# Altium schematic sheet MAIN_BOARD.SchDoc
size D; SheetNumber: 1; SheetTotal: 11
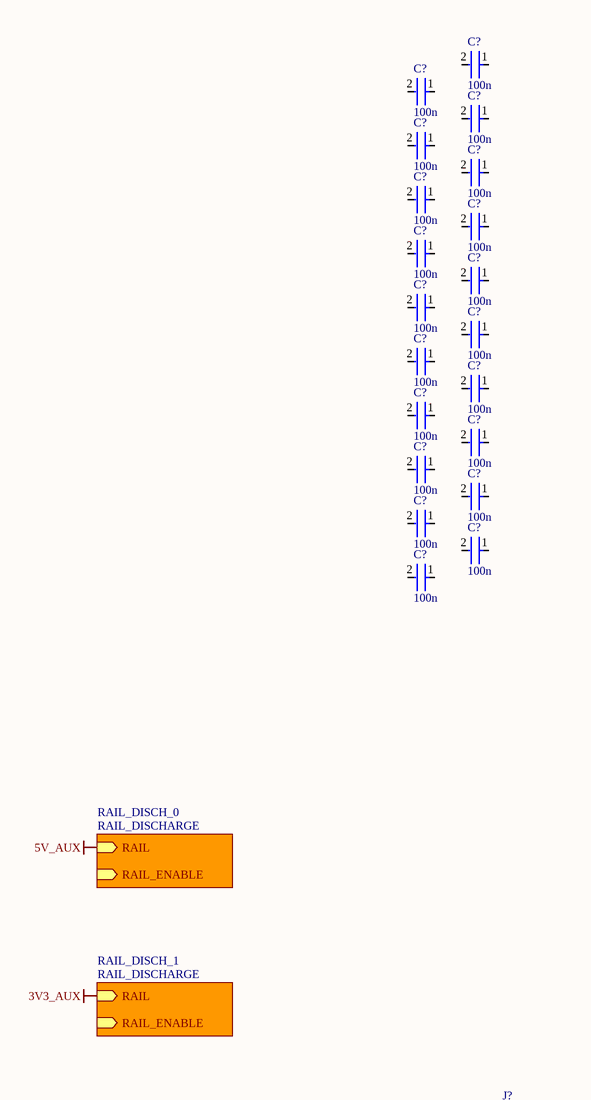
[diagram p0: MAIN_BOARD.SchDoc, top left]
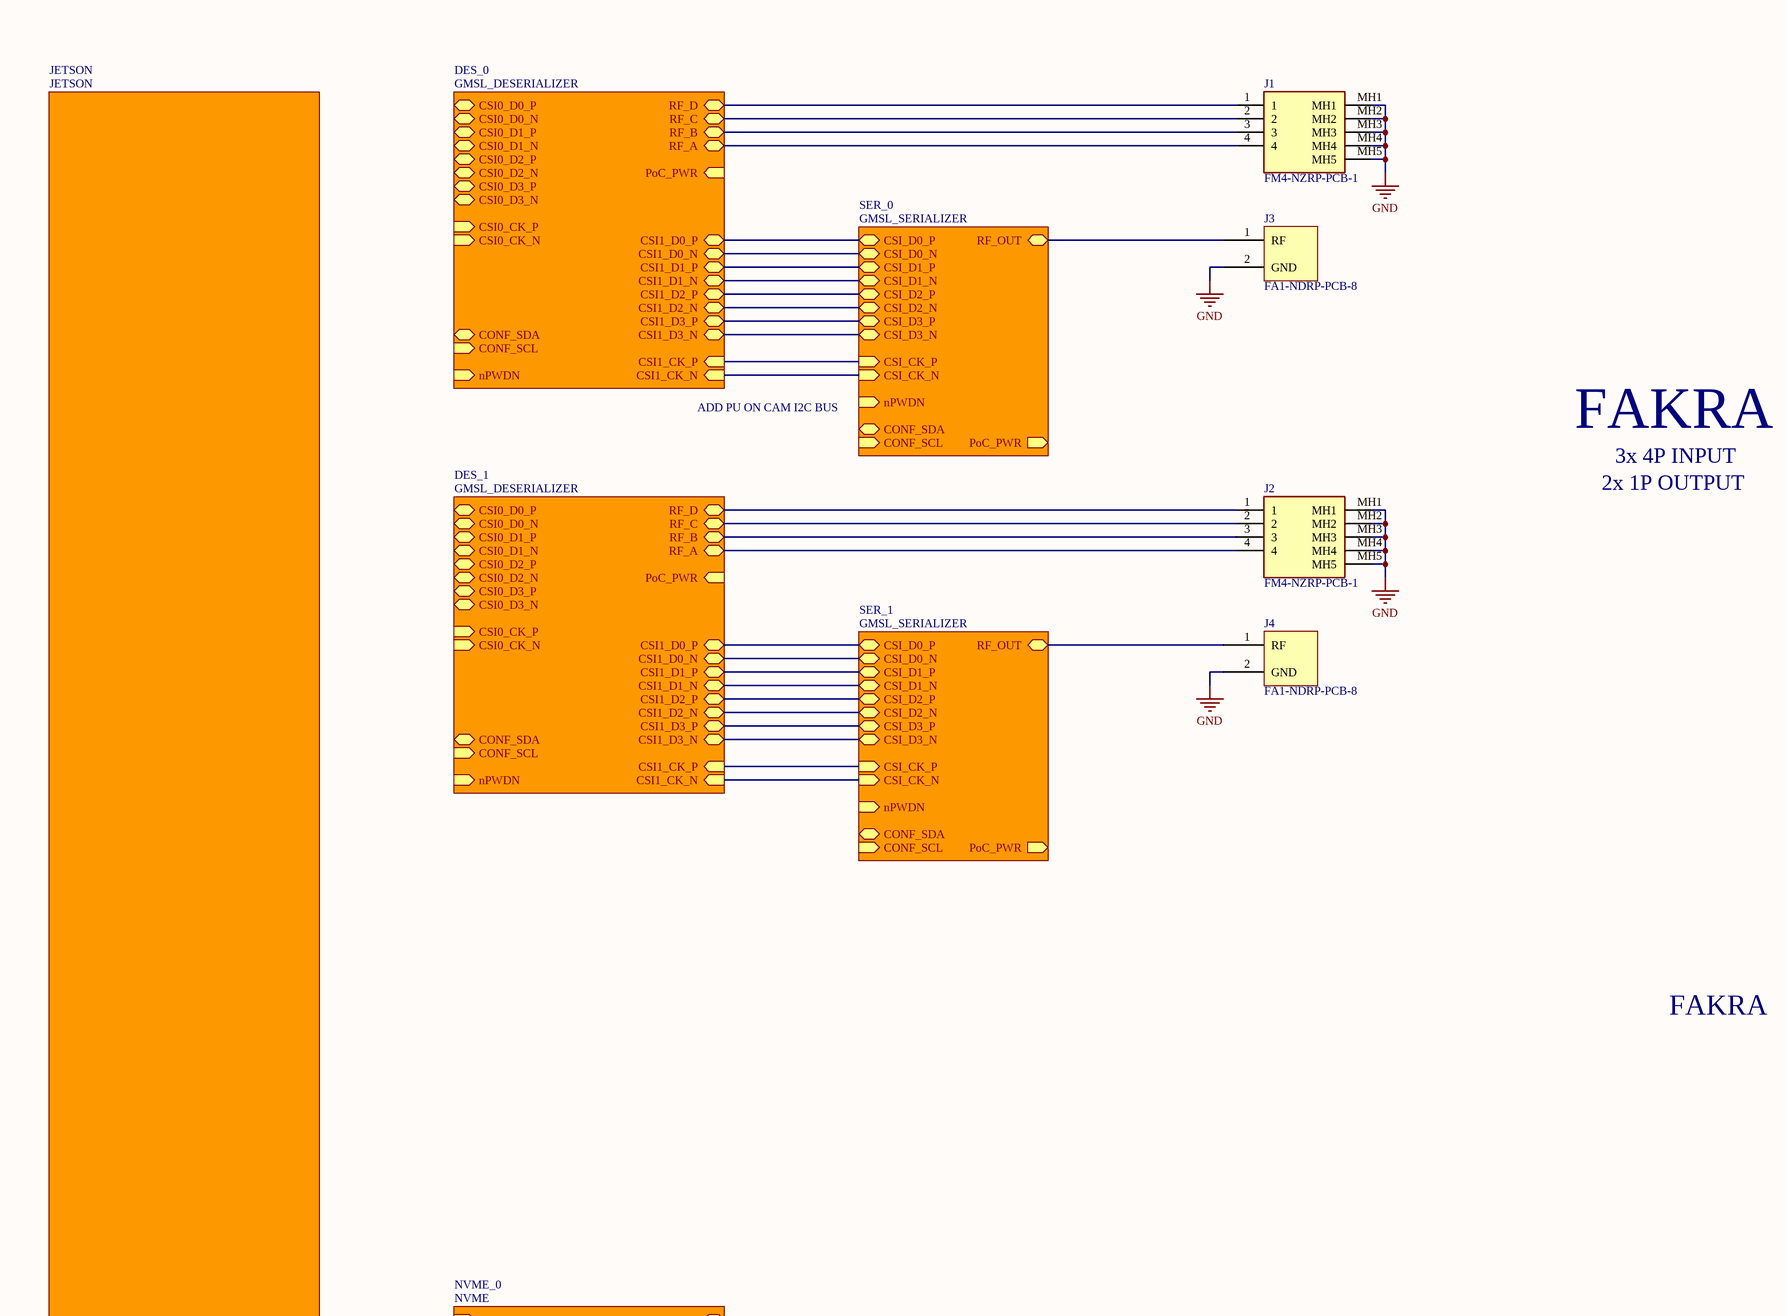
[diagram p1: MAIN_BOARD.SchDoc, top right]
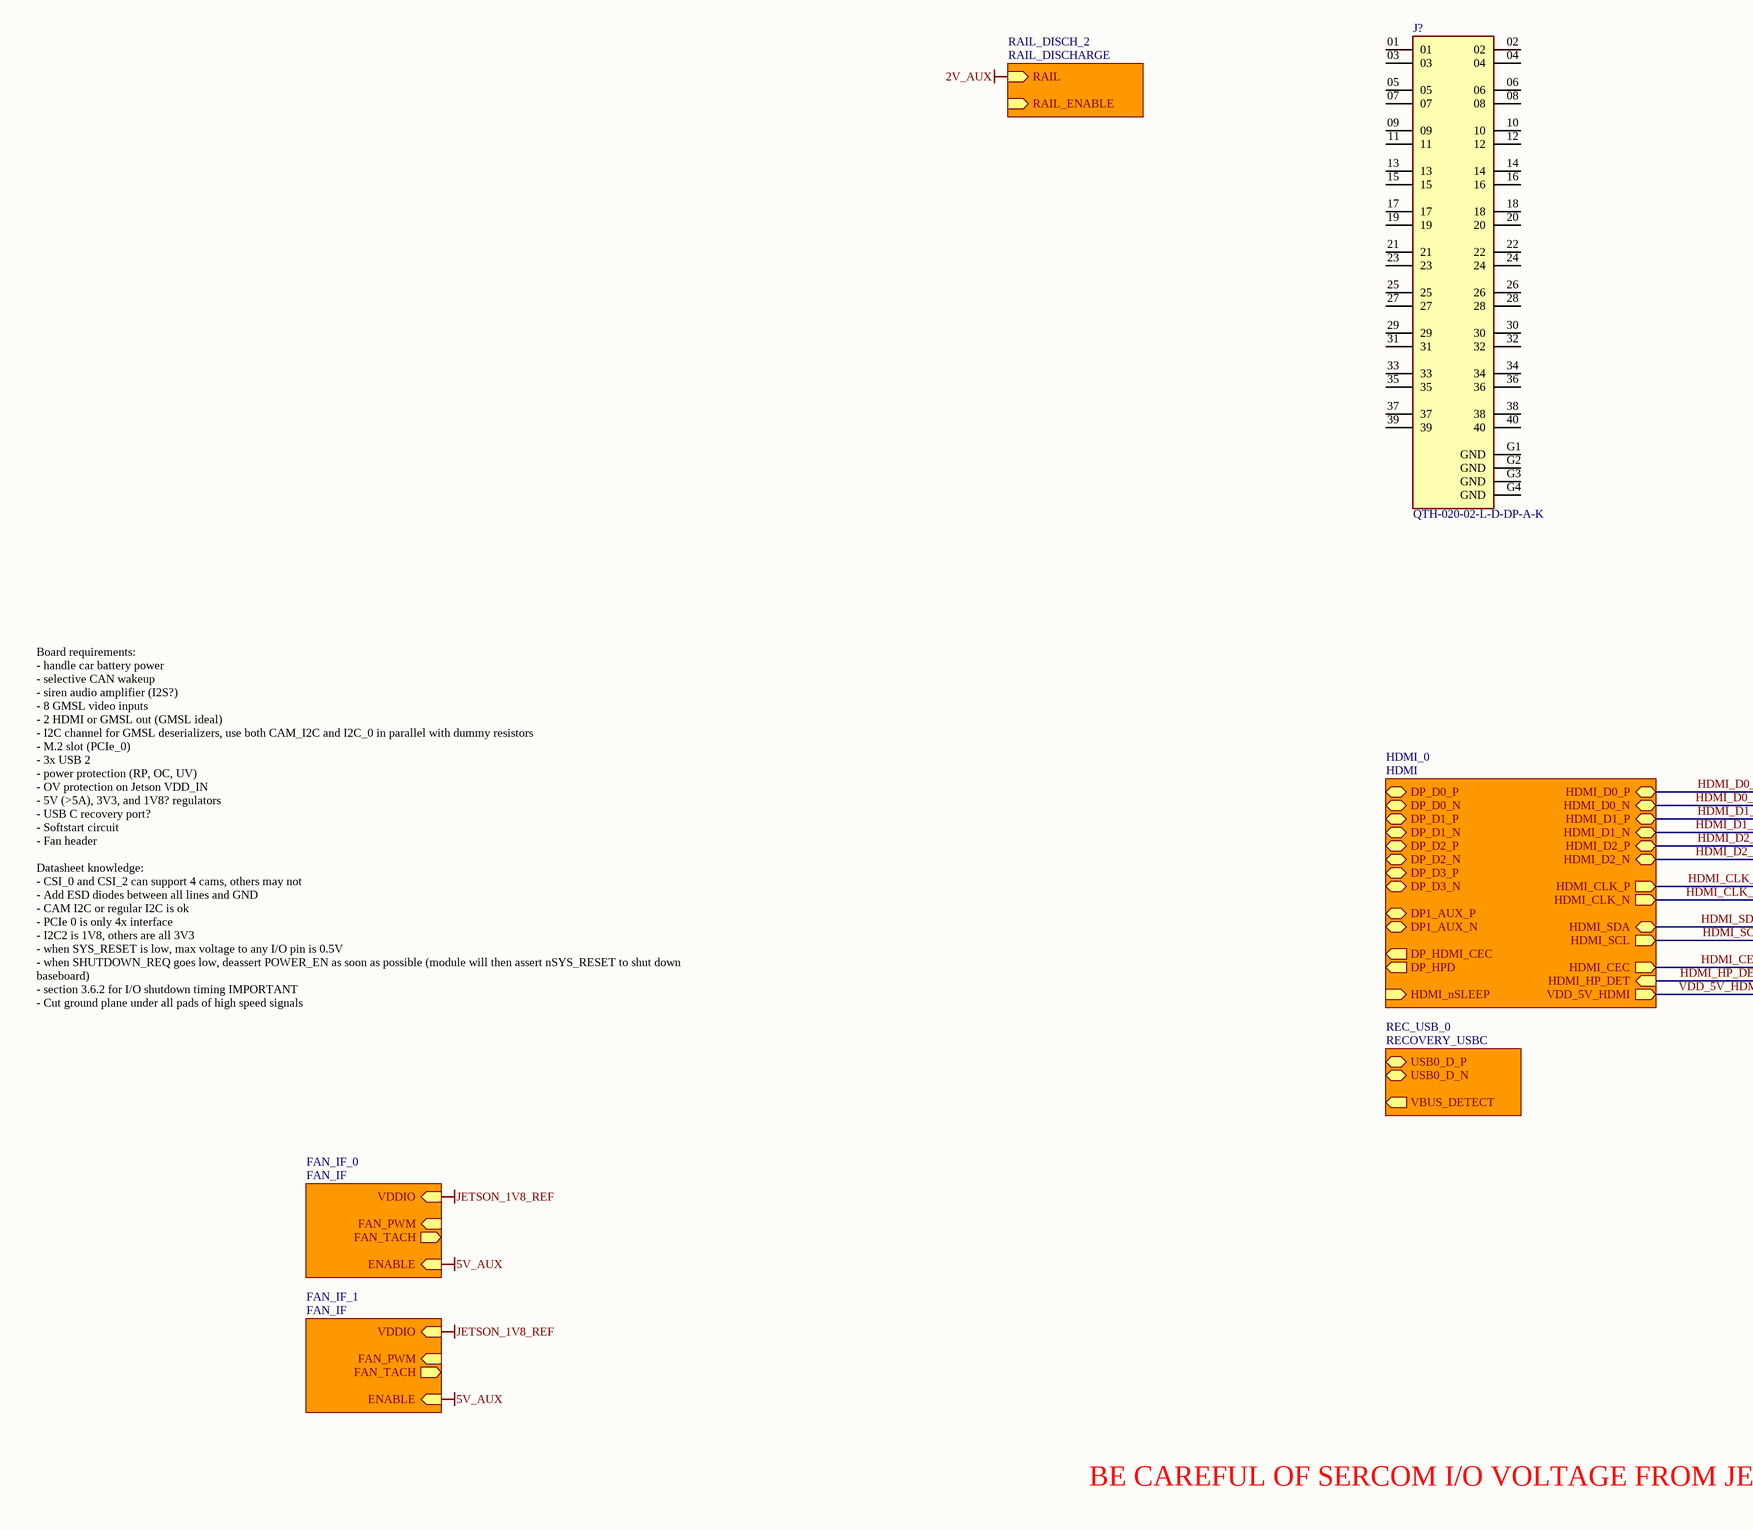
[diagram p2: MAIN_BOARD.SchDoc, bottom left]
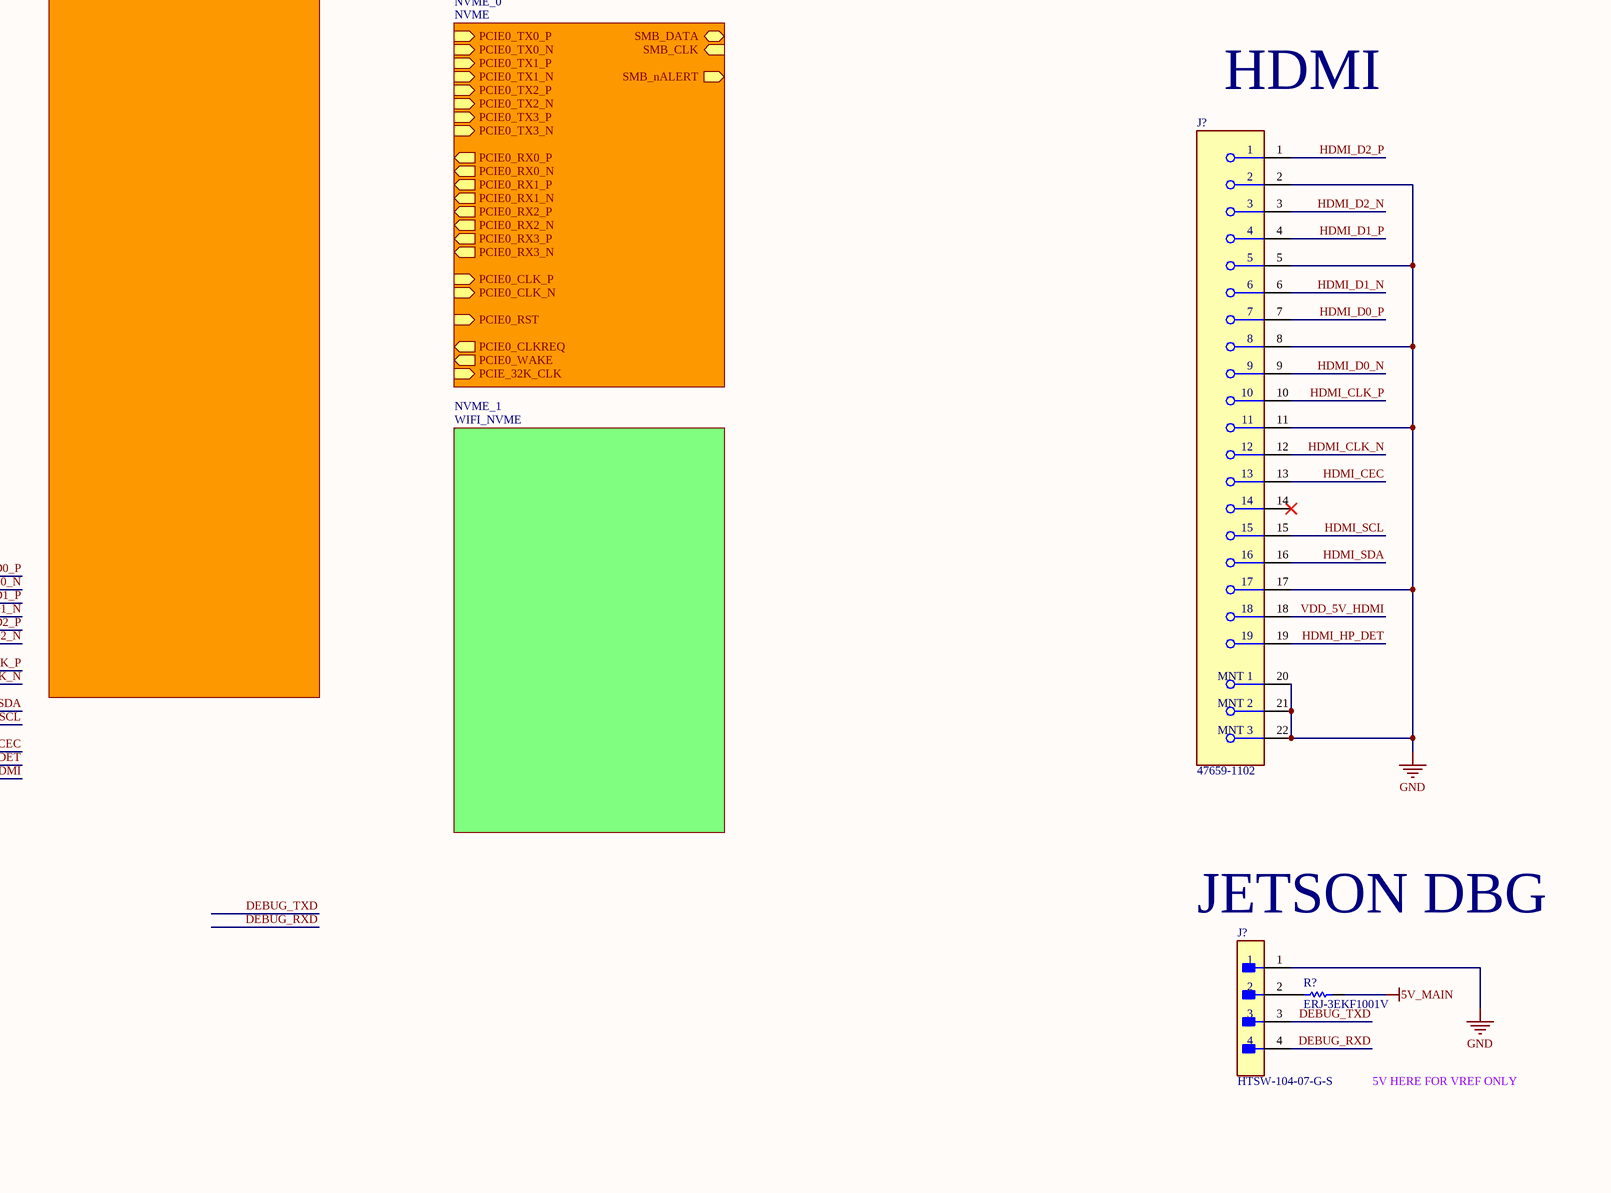
[diagram p3: MAIN_BOARD.SchDoc, bottom right]

## Parts
(Parts that share a designator on the sheet are numbered #1, #2 ... from top to bottom, then left to right.)
C?#1  100n  [FP-0402-L_1_0_0_05-W_0_5-IPC_A]
C?#2  100n  [FP-0402-L_1_0_0_05-W_0_5-IPC_A]
C?#3  100n  [FP-0402-L_1_0_0_05-W_0_5-IPC_A]
C?#4  100n  [FP-0402-L_1_0_0_05-W_0_5-IPC_A]
C?#5  100n  [FP-0402-L_1_0_0_05-W_0_5-IPC_A]
C?#6  100n  [FP-0402-L_1_0_0_05-W_0_5-IPC_A]
C?#7  100n  [FP-0402-L_1_0_0_05-W_0_5-IPC_A]
C?#8  100n  [FP-0402-L_1_0_0_05-W_0_5-IPC_A]
C?#9  100n  [FP-0402-L_1_0_0_05-W_0_5-IPC_A]
C?#10  100n  [FP-0402-L_1_0_0_05-W_0_5-IPC_A]
C?#11  100n  [FP-0402-L_1_0_0_05-W_0_5-IPC_A]
C?#12  100n  [FP-0402-L_1_0_0_05-W_0_5-IPC_A]
C?#13  100n  [FP-0402-L_1_0_0_05-W_0_5-IPC_A]
C?#14  100n  [FP-0402-L_1_0_0_05-W_0_5-IPC_A]
C?#15  100n  [FP-0402-L_1_0_0_05-W_0_5-IPC_A]
C?#16  100n  [FP-0402-L_1_0_0_05-W_0_5-IPC_A]
C?#17  100n  [FP-0402-L_1_0_0_05-W_0_5-IPC_A]
C?#18  100n  [FP-0402-L_1_0_0_05-W_0_5-IPC_A]
C?#19  100n  [FP-0402-L_1_0_0_05-W_0_5-IPC_A]
C?#20  100n  [FP-0402-L_1_0_0_05-W_0_5-IPC_A]
J1  FM4-NZRP-PCB-1  [FM4-NZRP-PCB-1-Footprint-1]
J2  FM4-NZRP-PCB-1  [FM4-NZRP-PCB-1-Footprint-1]
J3  FA1-NDRP-PCB-8  [FA1-NDRP-PCB-8-Footprint-1]
J4  FA1-NDRP-PCB-8  [FA1-NDRP-PCB-8-Footprint-1]
J?#1  QTH-020-02-L-D-DP-A-K  [QTH-020-02-L-D-DP-A-K-Footprint-1]
J?#2  47659-1102  [FP-47659-1102-MFG]
J?#3  HTSW-104-07-G-S  [FP-HTSW-104-07-G-S-MFG]
R?  ERJ-3EKF1001V  [RESC1608X55X30LL15T15]

## Sub-sheets
DES_0 = GMSL_DESERIALIZER: CSI0_D0_P (bidir), CSI0_D0_N (bidir), CSI0_D1_P (bidir), CSI0_D1_N (bidir), CSI0_D2_P (bidir), CSI0_D2_N (bidir), CSI0_D3_P (bidir), CSI0_D3_N (bidir), CSI0_CK_P (in), CSI0_CK_N (in), PoC_PWR (in), RF_B (bidir), RF_A (bidir), RF_C (bidir), RF_D (bidir), CSI1_D0_P (bidir), CSI1_D0_N (bidir), CSI1_D1_P (bidir), CSI1_D1_N (bidir), CSI1_D2_P (bidir), CSI1_D2_N (bidir), CSI1_D3_P (bidir), CSI1_D3_N (bidir), CSI1_CK_P (in), CSI1_CK_N (in), nPWDN (in), CONF_SDA (bidir), CONF_SCL (in)
DES_1 = GMSL_DESERIALIZER: CSI0_D0_P (bidir), CSI0_D0_N (bidir), CSI0_D1_P (bidir), CSI0_D1_N (bidir), CSI0_D2_P (bidir), CSI0_D2_N (bidir), CSI0_D3_P (bidir), CSI0_D3_N (bidir), CSI0_CK_P (in), CSI0_CK_N (in), PoC_PWR (in), RF_B (bidir), RF_A (bidir), RF_C (bidir), RF_D (bidir), CSI1_D0_P (bidir), CSI1_D0_N (bidir), CSI1_D1_P (bidir), CSI1_D1_N (bidir), CSI1_D2_P (bidir), CSI1_D2_N (bidir), CSI1_D3_P (bidir), CSI1_D3_N (bidir), CSI1_CK_P (in), CSI1_CK_N (in), nPWDN (in), CONF_SDA (bidir), CONF_SCL (in)
FAN_IF_0 = FAN_IF: FAN_PWM (in), FAN_TACH (out), VDDIO (in), ENABLE (in)
FAN_IF_1 = FAN_IF: FAN_PWM (in), FAN_TACH (out), VDDIO (in), ENABLE (in)
HDMI_0 = HDMI: DP_D0_P (bidir), DP_D0_N (bidir), DP_D1_P (bidir), DP_D1_N (bidir), DP_D2_P (bidir), DP_D2_N (bidir), DP_D3_P (bidir), DP_D3_N (bidir), DP1_AUX_P (bidir), DP1_AUX_N (bidir), DP_HDMI_CEC (out), DP_HPD (out), HDMI_nSLEEP (in), HDMI_D0_P (bidir), HDMI_D0_N (bidir), HDMI_D1_P (bidir), HDMI_D1_N (bidir), HDMI_D2_P (bidir), HDMI_D2_N (bidir), HDMI_CLK_P (out), HDMI_CLK_N (out), HDMI_SDA (bidir), HDMI_SCL (out), HDMI_CEC (out), HDMI_HP_DET (in), VDD_5V_HDMI (out)
JETSON = JETSON: no entries
NVME_0 = NVME: PCIE0_TX3_N (in), PCIE0_TX3_P (in), PCIE0_TX2_N (in), PCIE0_TX2_P (in), PCIE0_TX1_N (in), PCIE0_TX1_P (in), PCIE0_TX0_N (in), PCIE0_TX0_P (in), PCIE0_RX3_N (out), PCIE0_RX3_P (out), PCIE0_RX2_N (out), PCIE0_RX2_P (out), PCIE0_RX1_N (out), PCIE0_RX1_P (out), PCIE0_RX0_N (out), PCIE0_RX0_P (out), PCIE0_CLK_N (in), PCIE0_CLK_P (in), PCIE0_RST (in), PCIE0_CLKREQ (out), PCIE0_WAKE (out), PCIE_32K_CLK (in), SMB_DATA (bidir), SMB_CLK (in), SMB_nALERT (out)
NVME_1 = WIFI_NVME: no entries
RAIL_DISCH_0 = RAIL_DISCHARGE: RAIL (in), RAIL_ENABLE (in)
RAIL_DISCH_1 = RAIL_DISCHARGE: RAIL (in), RAIL_ENABLE (in)
RAIL_DISCH_2 = RAIL_DISCHARGE: RAIL (in), RAIL_ENABLE (in)
REC_USB_0 = RECOVERY_USBC: USB0_D_N (bidir), USB0_D_P (bidir), VBUS_DETECT (out)
SER_0 = GMSL_SERIALIZER: CSI_D0_P (bidir), CSI_D0_N (bidir), CSI_D1_P (bidir), CSI_D1_N (bidir), CSI_D2_P (bidir), CSI_D2_N (bidir), CSI_D3_P (bidir), CSI_D3_N (bidir), CSI_CK_P (in), CSI_CK_N (in), nPWDN (in), PoC_PWR (out), CONF_SDA (bidir), CONF_SCL (in), RF_OUT (bidir)
SER_1 = GMSL_SERIALIZER: CSI_D0_P (bidir), CSI_D0_N (bidir), CSI_D1_P (bidir), CSI_D1_N (bidir), CSI_D2_P (bidir), CSI_D2_N (bidir), CSI_D3_P (bidir), CSI_D3_N (bidir), CSI_CK_P (in), CSI_CK_N (in), nPWDN (in), PoC_PWR (out), CONF_SDA (bidir), CONF_SCL (in), RF_OUT (bidir)

## Nets
2V_AUX: sheet RAIL_DISCH_2/RAIL
3V3_AUX: sheet RAIL_DISCH_1/RAIL
5V_AUX: sheet FAN_IF_0/ENABLE, sheet FAN_IF_1/ENABLE, sheet RAIL_DISCH_0/RAIL
5V_MAIN: R?.1
GND: J1.MH1 J1.MH2 J1.MH3 J1.MH4 J1.MH5 J2.MH1 J2.MH2 J2.MH3 J2.MH4 J2.MH5 J3.2(GND) J4.2(GND) J?#2.2 J?#2.5 J?#2.8 J?#2.11 J?#2.17 J?#2.20(MNT_1) J?#2.21(MNT_2) J?#2.22(MNT_3) J?#3.1
JETSON_1V8_REF: sheet FAN_IF_0/VDDIO, sheet FAN_IF_1/VDDIO
DEBUG_RXD: J?#3.4
DEBUG_TXD: J?#3.3
HDMI_CEC: J?#2.13 ; sheet HDMI_0/HDMI_CEC
HDMI_CLK_N: J?#2.12 ; sheet HDMI_0/HDMI_CLK_N
HDMI_CLK_P: J?#2.10 ; sheet HDMI_0/HDMI_CLK_P
HDMI_D0_N: J?#2.9 ; sheet HDMI_0/HDMI_D0_N
HDMI_D0_P: J?#2.7 ; sheet HDMI_0/HDMI_D0_P
HDMI_D1_N: J?#2.6 ; sheet HDMI_0/HDMI_D1_N
HDMI_D1_P: J?#2.4 ; sheet HDMI_0/HDMI_D1_P
HDMI_D2_N: J?#2.3 ; sheet HDMI_0/HDMI_D2_N
HDMI_D2_P: J?#2.1 ; sheet HDMI_0/HDMI_D2_P
HDMI_HP_DET: J?#2.19 ; sheet HDMI_0/HDMI_HP_DET
HDMI_SCL: J?#2.15 ; sheet HDMI_0/HDMI_SCL
HDMI_SDA: J?#2.16 ; sheet HDMI_0/HDMI_SDA
VDD_5V_HDMI: J?#2.18 ; sheet HDMI_0/VDD_5V_HDMI
NetJ1_1: J1.1 ; sheet DES_0/RF_D
NetJ1_2: J1.2 ; sheet DES_0/RF_C
NetJ1_3: J1.3 ; sheet DES_0/RF_B
NetJ1_4: J1.4 ; sheet DES_0/RF_A
NetJ2_1: J2.1 ; sheet DES_1/RF_D
NetJ2_2: J2.2 ; sheet DES_1/RF_C
NetJ2_3: J2.3 ; sheet DES_1/RF_B
NetJ2_4: J2.4 ; sheet DES_1/RF_A
NetJ3_1: J3.1(RF) ; sheet SER_0/RF_OUT
NetJ4_1: J4.1(RF) ; sheet SER_1/RF_OUT
NetJ?#3_2: J?#3.2 R?.2
(unnamed): sheet SER_0/CSI_D0_P, sheet DES_0/CSI1_D0_P
(unnamed): sheet SER_0/CSI_D0_N, sheet DES_0/CSI1_D0_N
(unnamed): sheet SER_0/CSI_D1_P, sheet DES_0/CSI1_D1_P
(unnamed): sheet SER_0/CSI_D1_N, sheet DES_0/CSI1_D1_N
(unnamed): sheet SER_0/CSI_D2_P, sheet DES_0/CSI1_D2_P
(unnamed): sheet SER_0/CSI_D2_N, sheet DES_0/CSI1_D2_N
(unnamed): sheet SER_0/CSI_D3_P, sheet DES_0/CSI1_D3_P
(unnamed): sheet SER_0/CSI_D3_N, sheet DES_0/CSI1_D3_N
(unnamed): sheet SER_0/CSI_CK_P, sheet DES_0/CSI1_CK_P
(unnamed): sheet SER_0/CSI_CK_N, sheet DES_0/CSI1_CK_N
(unnamed): sheet SER_1/CSI_D0_P, sheet DES_1/CSI1_D0_P
(unnamed): sheet SER_1/CSI_D0_N, sheet DES_1/CSI1_D0_N
(unnamed): sheet SER_1/CSI_D1_P, sheet DES_1/CSI1_D1_P
(unnamed): sheet SER_1/CSI_D1_N, sheet DES_1/CSI1_D1_N
(unnamed): sheet SER_1/CSI_D2_P, sheet DES_1/CSI1_D2_P
(unnamed): sheet SER_1/CSI_D2_N, sheet DES_1/CSI1_D2_N
(unnamed): sheet SER_1/CSI_D3_P, sheet DES_1/CSI1_D3_P
(unnamed): sheet SER_1/CSI_D3_N, sheet DES_1/CSI1_D3_N
(unnamed): sheet SER_1/CSI_CK_P, sheet DES_1/CSI1_CK_P
(unnamed): sheet SER_1/CSI_CK_N, sheet DES_1/CSI1_CK_N

Not connected (* = marked no-connect by the designer): C?#1 1 2; C?#2 1 2; C?#3 1 2; C?#4 1 2; C?#5 1 2; C?#6 1 2; C?#7 1 2; C?#8 1 2; C?#9 1 2; C?#10 1 2; C?#11 1 2; C?#12 1 2; C?#13 1 2; C?#14 1 2; C?#15 1 2; C?#16 1 2; C?#17 1 2; C?#18 1 2; C?#19 1 2; C?#20 1 2; J?#1 01 02 03 04 05 06 07 08 09 10 11 12 13 14 15 16 17 18 19 20 21 22 23 24 25 26 27 28 29 30 31 32 33 34 35 36 37 38 39 40 G1(GND) G2(GND) G3(GND) G4(GND); J?#2 14*

## Notes on the sheet
- ADD PU ON CAM I2C BUS
- FAKRA
- 2x 1P OUTPUT
- 3x 4P INPUT
- HDMI
- Board requirements:
  - handle car battery power
  - selective CAN wakeup
  - siren audio amplifier (I2S?)
  - 8 GMSL video inputs
  - 2 HDMI or GMSL out (GMSL ideal)
  - I2C channel for GMSL deserializers, use both CAM_I2C and I2C_0 in parallel with dummy resistors
  - M.2 slot (PCIe_0)
  - 3x USB 2
  - power protection (RP, OC, UV)
  - OV protection on Jetson VDD_IN
  - 5V (>5A), 3V3, and 1V8? regulators
  - USB C recovery port?
  - Softstart circuit
  - Fan header
  Datasheet knowledge:
  - CSI_0 and CSI_2 can support 4 cams, others may not
  - Add ESD diodes between all lines and GND
  - CAM I2C or regular I2C is ok
  - PCIe 0 is only 4x interface
  - I2C2 is 1V8, others are all 3V3
  - when SYS_RESET is low, max voltage to any I/O pin is 0.5V
  - when SHUTDOWN_REQ goes low, deassert POWER_EN as soon as possible (module will then assert nSYS_RESET to shut down baseboard)
  - section 3.6.2 for I/O shutdown timing IMPORTANT
  - Cut ground plane under all pads of high speed signals
- (near J?#3) JETSON DBG
- 5V HERE FOR VREF ONLY
- BE CAREFUL OF SERCOM I/O VOLTAGE FROM JETSON

## Library data of the parts
C?#1-C?#20 = CMP-001-00058-1: LARGE PADS, 0402 CAP, CHANGE COMMENT TO MATCH REAL P/N; Capacitor Type: Ceramic; Min Operating Temperature: -55°C; Mounting Technology: Surface Mount; Pins: 2; Case/Package: 0402; RoHS Compliant: Yes; Max Operating Temperature: 85°C
J1 J2 = CMP-002-00044-4: Connector RF Mini-FAKRA Plug 9GHz 50Ohm Solder Right Angle Through Hole; Source: fakra4ch.SchLib; Component Type: Standard; Pins: 9; Design Item ID: CMP-002-00085-1
J3 J4 = CMP-002-00054-1: RF F Connector, Male, Board Mount, Solder Terminal, Plug; Connector Type: RF F CONNECTOR; RoHS Compliant: Yes; Mounting Technology: Board
J?#1 = CMP-002-00077-1: Board Stacking Connector; Connector Type: BOARD STACKING CONNECTOR; RoHS Compliant: Yes
J?#2 = CMP-04768-000010-1: HDMI REC.VERTICAL SMT TYPE W/HEI; RoHS Compliant: Yes
J?#3 = CMP-02766-001776-1: CONN HEADER VERT 4POS 2.54MM; Gender: Male; Number of Contacts: 4; Packaging: Bulk; RoHS Compliant: Yes; Number of Rows: 1; Mount: Through Hole; Contact Material: Bronze; Series: HTSW; Radiation Hardening: No; Pitch: 2.54mm; Reach SVHC Compliant: Yes; Contact Plating: Gold; Termination: Through Hole
R? = CMP-2000-00180-1: Manufacturer: Panasonic; Part Number: ERJ-3EKF1001V